# EAGLE design timelapse2routing (EAGLE 8.6.0)
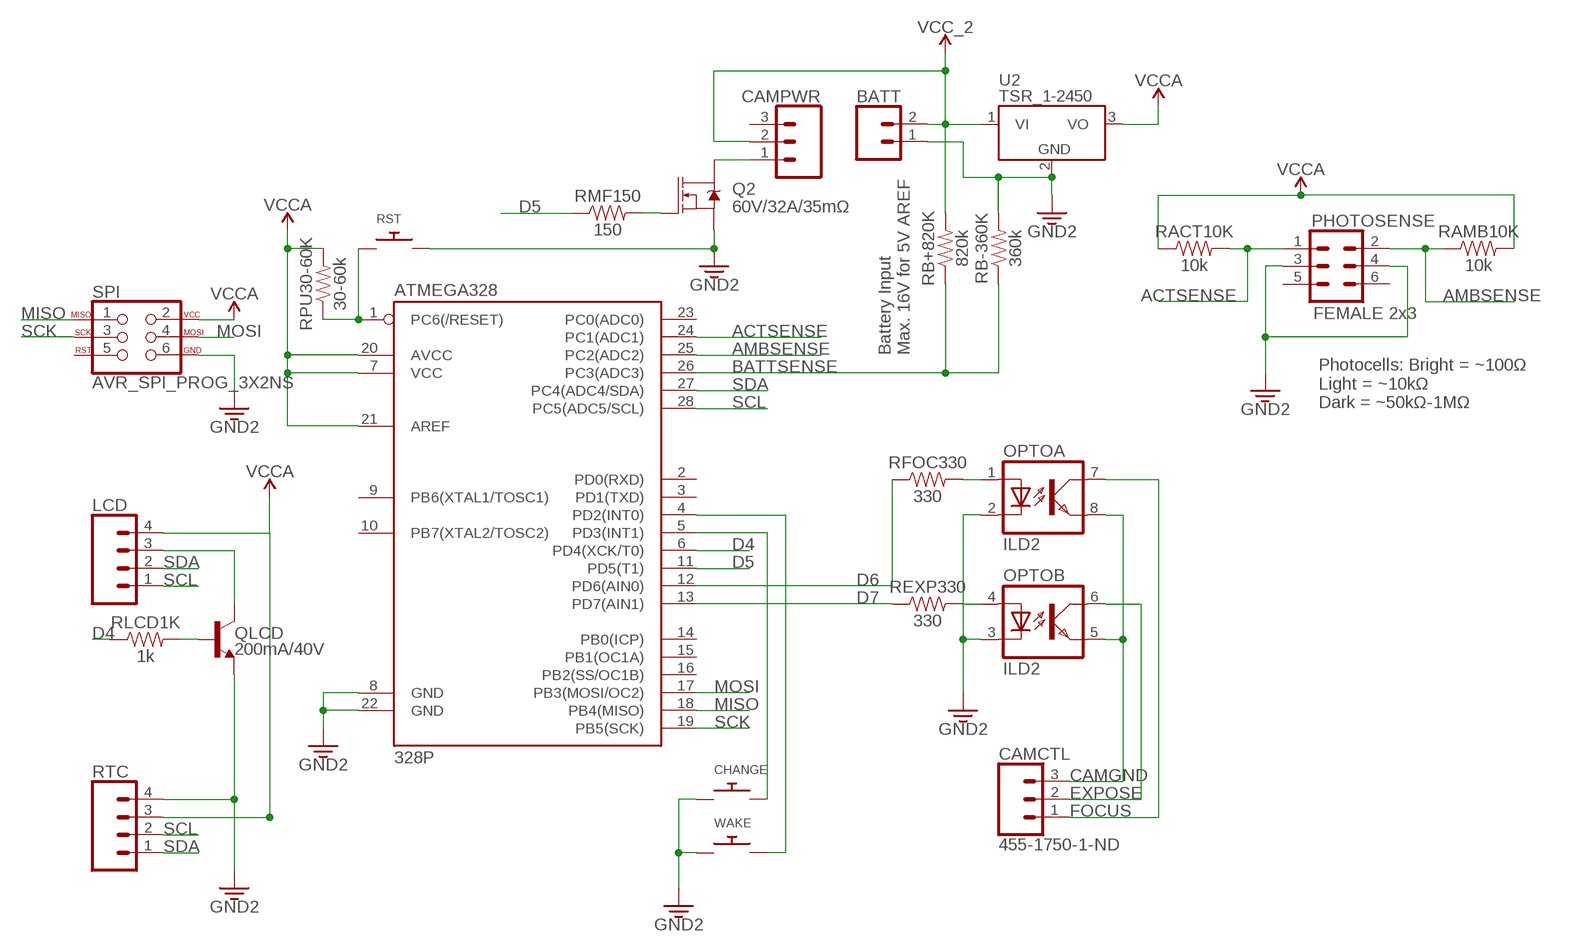
[diagram p0: schematic, sheet 1]

## Parts
ATMEGA328  328P  ATMEGA328P_PDIP  [DIP28]
BATT  CONN_02  [1X02]
CAMCTL  455-1750-1-ND  CONN_03  [1X03]
CAMPWR  CONN_03  [1X03]
CHANGE  SWITCH_PUSHBUTTONEVQ-PE  [TACT_PANA-EVQ]
LCD  CONN_04  [1X04]
OPTO  ILD2  [DIL08]
PHOTOSENSE  FEMALE 2x3  CONN_03X2FEMALE  [2X3]
Q2  60V/32A/35mΩ  MOSFET-NCH-FQP30N06L  [TO220V]
QLCD  200mA/40V  TRANS_NPN-2N3904  [TO-92]
RACT10K  10k  10KOHM-HORIZ-1/4W-1%  [AXIAL-0.3]
RAMB10K  10k  10KOHM-HORIZ-1/4W-1%  [AXIAL-0.3]
RB+820K  820k  10KOHM-HORIZ-1/4W-1%  [AXIAL-0.3]
RB-360K  360k  10KOHM-HORIZ-1/4W-1%  [AXIAL-0.3]
REXP330  330  330OHM-HORIZ-1/10W-5%  [AXIAL-0.3]
RFOC330  330  330OHM-HORIZ-1/10W-5%  [AXIAL-0.3]
RLCD1K  1k  330OHM-HORIZ-1/10W-5%  [AXIAL-0.3]
RMF150  150  330OHM-HORIZ-1/10W-5%  [AXIAL-0.3]
RPU30-60K  30-60k  330OHM-HORIZ-1/10W-5%  [AXIAL-0.3]
RST  SWITCH_PUSHBUTTONEVQ-PE  [TACT_PANA-EVQ]
RTC  CONN_04  [1X04]
SPI  AVR_SPI_PROG_3X2NS  [2X3-NS]
U2  TSR_1-2450  [TSR-1]
WAKE  SWITCH_PUSHBUTTONEVQ-PE  [TACT_PANA-EVQ]

## Nets
3.3V: ATMEGA328.8(GND) ATMEGA328.22(GND) ; supply symbol labelled GND2
ACTSENSE: ATMEGA328.24(PC1(ADC1)) PHOTOSENSE.1 RACT10K.P$2
AMBSENSE: ATMEGA328.25(PC2(ADC2)) PHOTOSENSE.2 RAMB10K.P$1
BATTSENSE: ATMEGA328.26(PC3(ADC3)) RB+820K.P$1 RB-360K.P$1
BATVCC [power]: BATT.2 CAMPWR.2 RB+820K.P$2 U2.1(VI) ; supply symbol labelled VCC_2
CAMGND: CAMCTL.3 OPTO.5(B:EMIT) OPTO.8(A:EMIT)
D4: ATMEGA328.6(PD4(XCK/T0)) RLCD1K.P$1
D5: ATMEGA328.11(PD5(T1)) RMF150.P$1
D6: ATMEGA328.12(PD6(AIN0)) RFOC330.P$1
D7: ATMEGA328.13(PD7(AIN1)) REXP330.P$1
EXPOSE: CAMCTL.2 OPTO.6(B:COL)
FOCUS: CAMCTL.1 OPTO.7(A:COL)
GND [power]: BATT.1 CHANGE.P$1 OPTO.2(A:C) OPTO.3(B:C) PHOTOSENSE.3 PHOTOSENSE.4 Q2.3(S) QLCD.1(E) RB-360K.P$2 RST.P$2 RTC.4 SPI.6 U2.2(GND) WAKE.P$1 ; supply symbol labelled GND2
MISO: ATMEGA328.18(PB4(MISO)) SPI.1
MOSI: ATMEGA328.17(PB3(MOSI/OC2)) SPI.4
N$1: OPTO.1(A:A) RFOC330.P$2
N$2: OPTO.4(B:A) REXP330.P$2
N$3: QLCD.2(B) RLCD1K.P$2
N$5 [power]: LCD.3 QLCD.3(C)
N$6: Q2.1(G) RMF150.P$2
N$7: ATMEGA328.5(PD3(INT1)) CHANGE.P$2
N$8: ATMEGA328.4(PD2(INT0)) WAKE.P$2
N$9 [power]: CAMPWR.1 Q2.2(D)
N$10: ATMEGA328.1(PC6(/RESET)) RPU30-60K.P$1 RST.P$1
SCK: ATMEGA328.19(PB5(SCK)) SPI.3
SCL: ATMEGA328.28(PC5(ADC5/SCL)) LCD.1 RTC.2
SDA: ATMEGA328.27(PC4(ADC4/SDA)) LCD.2 RTC.1
VCCA [power]: ATMEGA328.7(VCC) ATMEGA328.20(AVCC) ATMEGA328.21(AREF) LCD.4 RACT10K.P$1 RAMB10K.P$2 RPU30-60K.P$2 RTC.3 SPI.2 U2.3(VO)
Unconnected: ATMEGA328.2(PD0(RXD)) ATMEGA328.3(PD1(TXD)) ATMEGA328.9(PB6(XTAL1/TOSC1)) ATMEGA328.10(PB7(XTAL2/TOSC2)) ATMEGA328.14(PB0(ICP)) ATMEGA328.15(PB1(OC1A)) ATMEGA328.16(PB2(SS/OC1B)) ATMEGA328.23(PC0(ADC0)) CAMPWR.3 PHOTOSENSE.5 PHOTOSENSE.6 SPI.5

## Notes on the sheet
- Battery Input
  Max. 16V for 5V AREF
- Photocells: Bright = ~100Ω
  Light = ~10kΩ
  Dark = ~50kΩ-1MΩ

## Library data of the parts
ATMEGA328 = SparkFun-IC-Microcontroller:ATMEGA328P_PDIP: Atmel 328P Through hole ATMEGA328P uC used in the Arduino 32kb flash, 1k EEPROM, 2k SRAM Datasheet <http://www.sparkfun.com/datasheets/Components/SMD/ATMega328.pdf> SparkFun Products Storefront component: AVR 28 Pin 20MHz 32K 6A/D - ATMega328P <https://www.sparkfun.com/products/9061> (COM-09061) SparkFun Simon Says - Through-Hole Soldering Kit <https://www.sparkfun.com/products/10547> (KIT-10547) SparkFun Learn to Solder - Simon Says <https://www.sparkfun.com/products/13708> (KIT-13708) SparkFun BigTime Watch Kit <https://www.sparkfun.com/products/11734> (KIT-11734) SparkFun ClockIt <https://www.sparkfun.com/products/10930> (KIT-10930) SparkFun Serial Enabled LCD Kit <https://www.sparkfun.com/products/10097> (LCD-10097) SparkFun Simon Tilts - Through Hole Soldering Kit <https://www.sparkfun.com/products/12634> (KIT-12634) SparkFun Frequency Counter Kit <https://www.sparkfun.com/products/10140> (KIT-10140) FabFM Radio Kit <https://www.sparkfun.com/products/11043> (KIT-11043) SparkFun Binary Blaster Kit <https://www.sparkfun.com/products/12037> (KIT-12037) SparkFun Metro-Gnome <https://www.sparkfun.com/products/9236> (KIT-09236) ATmega328 with Arduino Optiboot (Uno) <https://www.sparkfun.com/products/10524> (DEV-10524); PROD_ID: IC-09136
BATT = SparkFun-Connectors:CONN_02: Multi connection point. Often used as Generic Header-pin footprint for 0.1 inch spaced/style header connections On any of the 0.1 inch spaced packages, you can populate with these: Break Away Headers - Straight <https://www.sparkfun.com/products/116> (PRT-00116) Break Away Male Headers - Right Angle <https://www.sparkfun.com/products/553> (PRT-00553) Female Headers <https://www.sparkfun.com/products/115> (PRT-00115) Break Away Headers - Machine Pin <https://www.sparkfun.com/products/117> (PRT-00117) Break Away Female Headers - Swiss Machine Pin <https://www.sparkfun.com/products/743> (PRT-00743) For SCREWTERMINALS and SPRING TERMINALS visit here: Screw Terimnals on SparkFun.com <https://www.sparkfun.com/search/results?term=Screw+Terminals> (5mm/3.5mm/2.54mm spacing) This device is also useful as a general connection point to wire up your design to another part of your project. Our various solder wires solder well into these plated through hole pads. Hook-Up Wire - Assortment (Stranded, 22 AWG) <https://www.sparkfun.com/products/11375> (PRT-11375) Hook-Up Wire - Assortment (Solid Core, 22 AWG) <https://www.sparkfun.com/products/11367> (PRT-11367) View the entire wire category on our website here <https://www.sparkfun.com/categories/141> Special notes: Molex polarized connector foot print use with: PRT-08233 with associated crimp pins and housings. 2.54_SCREWTERM for use with PRT-10571. 3.5mm Screw Terminal footprints for PRT-08084 5mm Screw Terminal footprints for use with PRT-08432
CAMCTL = SparkFun-Connectors:CONN_03: Multi connection point. Often used as Generic Header-pin footprint for 0.1 inch spaced/style header connections On any of the 0.1 inch spaced packages, you can populate with these: Break Away Headers - Straight <https://www.sparkfun.com/products/116> (PRT-00116) Break Away Male Headers - Right Angle <https://www.sparkfun.com/products/553> (PRT-00553) Female Headers <https://www.sparkfun.com/products/115> (PRT-00115) Break Away Headers - Machine Pin <https://www.sparkfun.com/products/117> (PRT-00117) Break Away Female Headers - Swiss Machine Pin <https://www.sparkfun.com/products/743> (PRT-00743) Stackable Header - 3 Pin (Female, 0.1") <https://www.sparkfun.com/products/13875> (PRT-13875) For SCREWTERMINALS and SPRING TERMINALS visit here: Screw Terimnals on SparkFun.com <https://www.sparkfun.com/search/results?term=Screw+Terminals> (5mm/3.5mm/2.54mm spacing) This device is also useful as a general connection point to wire up your design to another part of your project. Our various solder wires solder well into these plated through hole pads. Hook-Up Wire - Assortment (Stranded, 22 AWG) <https://www.sparkfun.com/products/11375> (PRT-11375) Hook-Up Wire - Assortment (Solid Core, 22 AWG) <https://www.sparkfun.com/products/11367> (PRT-11367) View the entire wire category on our website here <https://www.sparkfun.com/categories/141> Special notes: Molex polarized connector foot print use with SKU : PRT-08232 with associated crimp pins and housings.; PROD_ID: XXX-00000
CAMPWR = SparkFun-Connectors:CONN_03: Multi connection point. Often used as Generic Header-pin footprint for 0.1 inch spaced/style header connections On any of the 0.1 inch spaced packages, you can populate with these: Break Away Headers - Straight <https://www.sparkfun.com/products/116> (PRT-00116) Break Away Male Headers - Right Angle <https://www.sparkfun.com/products/553> (PRT-00553) Female Headers <https://www.sparkfun.com/products/115> (PRT-00115) Break Away Headers - Machine Pin <https://www.sparkfun.com/products/117> (PRT-00117) Break Away Female Headers - Swiss Machine Pin <https://www.sparkfun.com/products/743> (PRT-00743) Stackable Header - 3 Pin (Female, 0.1") <https://www.sparkfun.com/products/13875> (PRT-13875) For SCREWTERMINALS and SPRING TERMINALS visit here: Screw Terimnals on SparkFun.com <https://www.sparkfun.com/search/results?term=Screw+Terminals> (5mm/3.5mm/2.54mm spacing) This device is also useful as a general connection point to wire up your design to another part of your project. Our various solder wires solder well into these plated through hole pads. Hook-Up Wire - Assortment (Stranded, 22 AWG) <https://www.sparkfun.com/products/11375> (PRT-11375) Hook-Up Wire - Assortment (Solid Core, 22 AWG) <https://www.sparkfun.com/products/11367> (PRT-11367) View the entire wire category on our website here <https://www.sparkfun.com/categories/141> Special notes: Molex polarized connector foot print use with SKU : PRT-08232 with associated crimp pins and housings.; PROD_ID: XXX-00000; VALUE: 455-1750-1-ND
CHANGE RST WAKE = adafruit:SWITCH_PUSHBUTTON: Buttons SOFTTOUCHSMD_SJ - Soft touch temporary push button (Super Junk Akihabara) Compatible with SKPMANE010 [Mouser: 688-SKPMAN] C&K_KSS = Digikey: KSS221GLFS
LCD RTC = SparkFun-Connectors:CONN_04: Multi connection point. Often used as Generic Header-pin footprint for 0.1 inch spaced/style header connections On any of the 0.1 inch spaced packages, you can populate with these: Break Away Headers - Straight <https://www.sparkfun.com/products/116> (PRT-00116) Break Away Male Headers - Right Angle <https://www.sparkfun.com/products/553> (PRT-00553) Female Headers <https://www.sparkfun.com/products/115> (PRT-00115) Break Away Headers - Machine Pin <https://www.sparkfun.com/products/117> (PRT-00117) Break Away Female Headers - Swiss Machine Pin <https://www.sparkfun.com/products/743> (PRT-00743) For SCREWTERMINALS and SPRING TERMINALS visit here: Screw Terimnals on SparkFun.com <https://www.sparkfun.com/search/results?term=Screw+Terminals> (5mm/3.5mm/2.54mm spacing) This device is also useful as a general connection point to wire up your design to another part of your project. Our various solder wires solder well into these plated through hole pads. Hook-Up Wire - Assortment (Stranded, 22 AWG) <https://www.sparkfun.com/products/11375> (PRT-11375) Hook-Up Wire - Assortment (Solid Core, 22 AWG) <https://www.sparkfun.com/products/11367> (PRT-11367) View the entire wire category on our website here <https://www.sparkfun.com/categories/141> Special notes: Molex polarized connector foot print use with SKU : PRT-08231 with associated crimp pins and housings. 1MM SMD Version SKU: PRT-10208; PROD_ID: CONN-09696
OPTO = optocoupler-2:ILD2: SIEMENS OPTO COUPLER
PHOTOSENSE = SparkFun-Connectors:CONN_03X2: Multi connection point. Often used as Generic Header-pin footprint for 0.1 inch spaced/style header connections You can populate with any combo of single row headers, but if you'd like an exact match, check these: Header - 2x3 (Male, 0.1") <https://www.sparkfun.com/products/12807> (PRT-12807) Header - 2x3 (Female, 0.1") <https://www.sparkfun.com/products/13010> (PRT-13010) 2x3 Pin Shrouded Header <https://www.sparkfun.com/products/10877> (PRT-10877) On any of the 0.1 inch spaced packages, you can populate with these: Break Away Headers - Straight <https://www.sparkfun.com/products/116> (PRT-00116) Break Away Male Headers - Right Angle <https://www.sparkfun.com/products/553> (PRT-00553) Female Headers <https://www.sparkfun.com/products/115> (PRT-00115) Break Away Headers - Machine Pin <https://www.sparkfun.com/products/117> (PRT-00117) Break Away Female Headers - Swiss Machine Pin <https://www.sparkfun.com/products/743> (PRT-00743) Special note: the shrouded connector mates well with our 3x2 ribbon cables: Ribbon Crimp Connector - 6-pin (2x3, Female) <https://www.sparkfun.com/products/10651> (PRT-10651) Ribbon Cable - 6 wire (15ft) <https://www.sparkfun.com/products/10646> (PRT-10646); PROD_ID: CONN-11566
Q2 = SparkFun-DiscreteSemi:MOSFET-NCH: N-channel MOSFETs Voltage controlled devices that allow control of high current outputs. SparkFun Products: SparkFun OpenScale <https://www.sparkfun.com/products/13261> SparkFun Digital Sandbox <https://www.sparkfun.com/products/12651> SparkFun Monster Moto Shield <https://www.sparkfun.com/products/10182> SparkFun MOSFET Power Controller <https://www.sparkfun.com/products/11214>; PROD_ID: TRANS-10060
QLCD = SparkFun-DiscreteSemi:TRANS_NPN: NPN transistor Current controlled devices typically used to amplify current or used as a switch. BC547 - COM-08928 <http://www.sparkfun.com/products/8928> (TO-92 45V 100mA) (1.Collector 2.Base 3.Emitter) 2N3904 - COM-00521 <http://www.sparkfun.com/products/521> (TO-92 40V 200mA) (1.Emitter 2.Base 3.Collector) P2N2222A - COM-12852 <http://www.sparkfun.com/products/12852> (TO-92 40V 600mA) (1.Collector 2.Base 3.Emitter); PROD_ID: TRANS-08447
RACT10K RAMB10K = SparkFun-Resistors:10KOHM: 10kΩ resistor A resistor is a passive two-terminal electrical component that implements electrical resistance as a circuit element. Resistors act to reduce current flow, and, at the same time, act to lower voltage levels within circuits. - Wikipedia; PROD_ID: RES-12183
RB+820K RB-360K = SparkFun-Resistors:10KOHM: 10kΩ resistor A resistor is a passive two-terminal electrical component that implements electrical resistance as a circuit element. Resistors act to reduce current flow, and, at the same time, act to lower voltage levels within circuits. - Wikipedia; PROD_ID: RES-12183; VALUE: 10k
REXP330 RFOC330 = SparkFun-Resistors:330OHM: 330Ω resistor A resistor is a passive two-terminal electrical component that implements electrical resistance as a circuit element. Resistors act to reduce current flow, and, at the same time, act to lower voltage levels within circuits. - Wikipedia; PROD_ID: RES-8371
RLCD1K RMF150 RPU30-60K = SparkFun-Resistors:330OHM: 330Ω resistor A resistor is a passive two-terminal electrical component that implements electrical resistance as a circuit element. Resistors act to reduce current flow, and, at the same time, act to lower voltage levels within circuits. - Wikipedia; PROD_ID: RES-8371; VALUE: 330
SPI = SparkFun-Connectors:AVR_SPI_PROG_3X2: AVR ISP 6 Pin This is the reduced ISP connector for AVR programming. Common on Arduino. This footprint will take up less PCB space and can be used with a 10-pin to 6-pin adapter such as SKU: BOB-08508 **Special note about "TEST_POINT" package. The stop mask is on the top side, so if you want your programming test points to be on the bottom of your board, make sure to place this package on the bottom side of the board. This also ensure that the orientation to program from the bottom side will be correct. SparkFun Products: SparkFun ISP Pogo Adapter <https://www.sparkfun.com/products/11591> - NS Tiny AVR Programmer <https://www.sparkfun.com/products/11801> -PTH
U2 = _traco_tsr-1:TSR_1-*: TRACO TSR-1 Series Point-of-Load DC/DC-Converters Vi max. 36 V; Vo = (1.2 .. 15)V ±2%; Io = 0 .. 1 A SIP-Package (drop-in replacement for 78xx linear voltage regulators in TO220-package, vertically assembled) Source: www.tracopower.com Technologies: TSR 1- Vi (V) Vo (V) ±2% Io = 0 .. 1 A 24_ ( generic ) 2412 4.6 .. 36 1.2 2415 4.6 .. 36 1.5 2418 4.6 .. 36 1.8 2425 4.6 .. 36 2.5 2433 4.75.. 36 3.3 2450 6.5 .. 36 5.0 2465 9.0 .. 36 6.5 2490 12 .. 36 9.0 24120 15 .. 36 12 24150 18 .. 36 15 Author: Dipl.-Ing. FH Rainer Bayer HHN Hochschule Heilbronn, rainer.bayer@hs-heilbronn.de Ingenieurbüro ing-rb, mail@ing-rb.de

## Net classes
1 power: width 0.406 mm

## Board
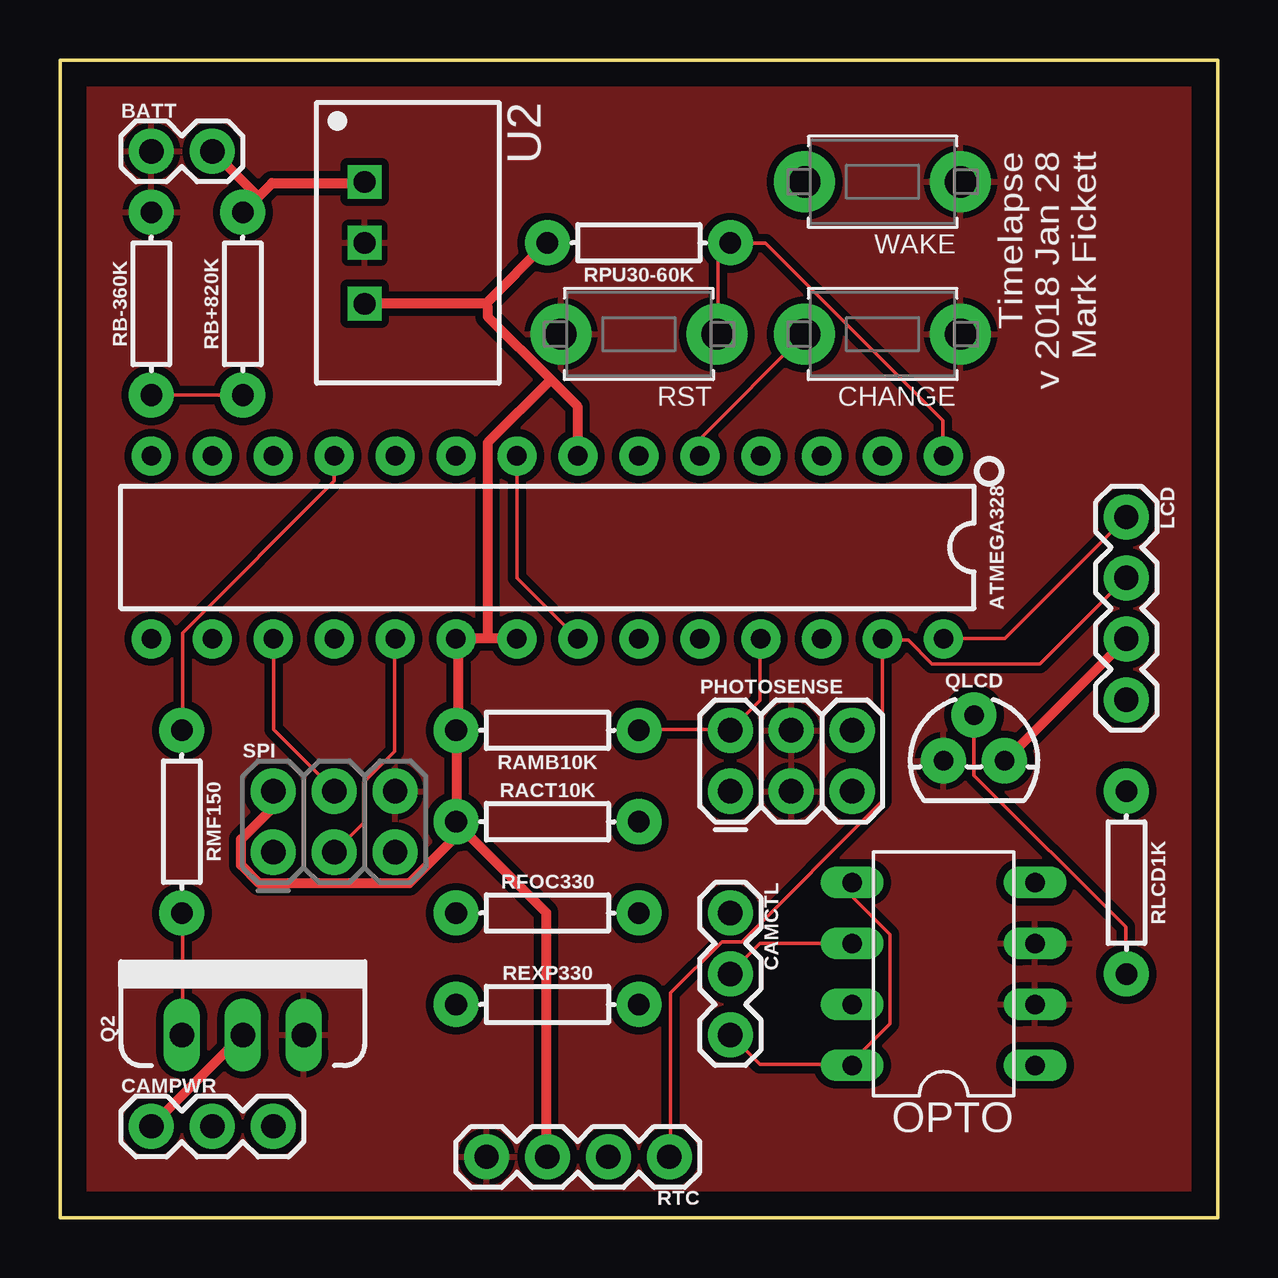
[diagram p1: board, top side]
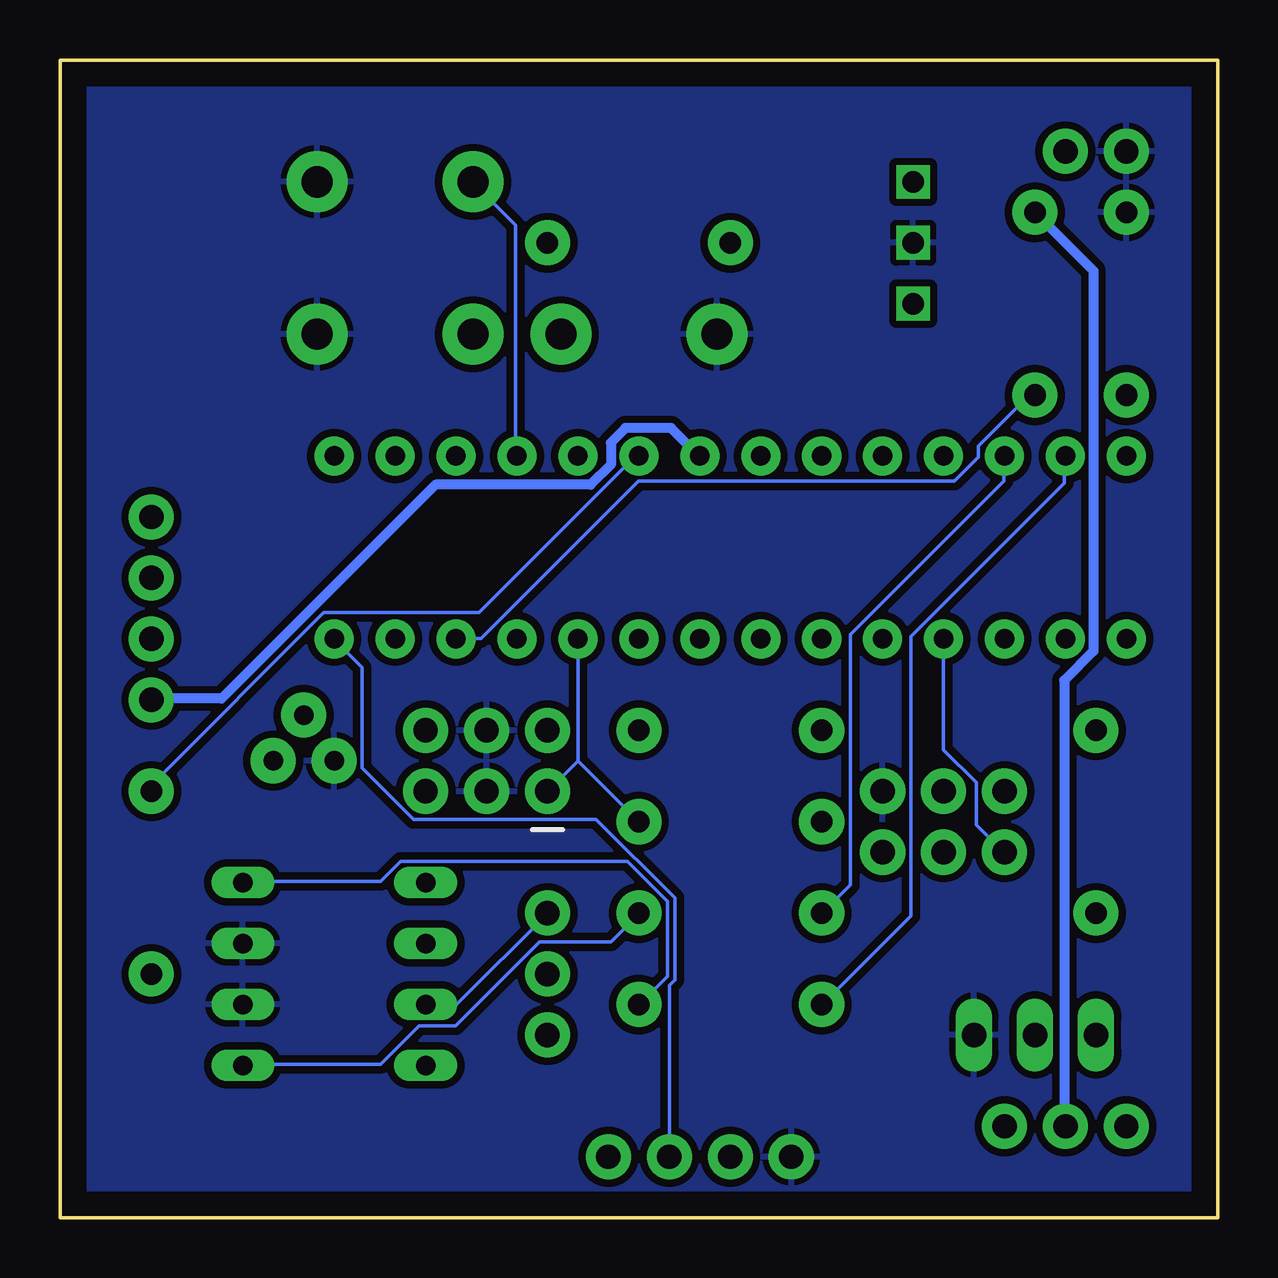
[diagram p2: board, bottom side, seen from below]

Size 48.26 x 48.26 mm. Coordinates in mm from the lower left corner, seen from the top.
Outline: 0,0 0,48.26 48.26,48.26 48.26,0 0,0
Copper layers (1*16): Top 0.035mm / dielectric 1.5mm / Bottom 0.035mm
Design rules "default": minimum track width 6mil, minimum drill 0.35mm, track to track 6mil, track to pad 6mil, pad to pad 6mil, via to via 6mil, smd to smd 6mil, copper to edge 40mil, drill to drill 6mil, minimum pad ring 10mil, minimum via ring 8mil, stop-mask expansion 4mil, vias tented up to drill 0mil, thermal gap 10mil

### Footprints (pad centres in the part's own frame; a part is rotated, then mirrored left to right if it is on the bottom)
DIP28 = drill 0.813 pad 1.626: 1 -16.51,-3.81; 2 -13.97,-3.81; 3 -11.43,-3.81; 4 -8.89,-3.81; 5 -6.35,-3.81; 6 -3.81,-3.81; 7 -1.27,-3.81; 8 1.27,-3.81; 9 3.81,-3.81; 10 6.35,-3.81; 11 8.89,-3.81; 12 11.43,-3.81; 13 13.97,-3.81; 14 16.51,-3.81; 15 16.51,3.81; 16 13.97,3.81; 17 11.43,3.81; 18 8.89,3.81; 19 6.35,3.81; 20 3.81,3.81; 21 1.27,3.81; 22 -1.27,3.81; 23 -3.81,3.81; 24 -6.35,3.81; 25 -8.89,3.81; 26 -11.43,3.81; 27 -13.97,3.81; 28 -16.51,3.81
1X02 = drill 1.016 pad 1.88: 1 0,0; 2 2.54,0
1X03 = drill 1.016 pad 1.88: 1 0,0; 2 2.54,0; 3 5.08,0
TACT_PANA-EVQ = drill 1.3 pad 2.54: P$1 -3.25,0; P$2 3.25,0
1X04 = drill 1.016 pad 1.88: 1 0,0; 2 2.54,0; 3 5.08,0; 4 7.62,0
DIL08 = drill 0.813 long: 1 -3.81,-3.81; 2 -1.27,-3.81; 3 1.27,-3.81; 4 3.81,-3.81; 5 3.81,3.81; 6 1.27,3.81; 7 -1.27,3.81; 8 -3.81,3.81
2X3 = drill 1.016 pad 1.88: 1 0,0; 2 0,2.54; 3 2.54,0; 4 2.54,2.54; 5 5.08,0; 6 5.08,2.54
TO220V = drill 1.016 long: 1 -2.54,0; 2 0,0; 3 2.54,0
TO-92 = drill 0.813 pad 1.88: 1 -1.27,0; 2 0,1.905; 3 1.27,0
AXIAL-0.3 = drill 0.9 pad 1.88: P$1 -3.81,0; P$2 3.81,0
2X3-NS = drill 1.016 pad 1.88: 1 -2.54,-1.27; 2 -2.54,1.27; 3 0,-1.27; 4 0,1.27; 5 2.54,-1.27; 6 2.54,1.27
TSR-1 = drill 0.9 square: 1 -2.54,0; 2 0,0; 3 2.54,0

### Placement (x,y rotation side)
ATMEGA328  20.32,27.94 180 top
BATT  3.81,44.45 0 top
CAMCTL  27.94,12.7 270 top
CAMPWR  3.81,3.81 0 top
CHANGE  34.29,36.83 180 top
LCD  44.45,29.21 270 top
OPTO  36.83,10.16 90 top
PHOTOSENSE  27.94,17.78 0 top
Q2  7.62,7.62 0 top
QLCD  38.1,19.05 0 top
RACT10K  20.32,16.51 0 top
RAMB10K  20.32,20.32 180 top
RB+820K  7.62,38.1 90 top
RB-360K  3.81,38.1 90 top
REXP330  20.32,8.89 0 top
RFOC330  20.32,12.7 0 top
RLCD1K  44.45,13.97 270 top
RMF150  5.08,16.51 270 top
RPU30-60K  24.13,40.64 180 top
RST  24.13,36.83 180 top
RTC  25.4,2.54 180 top
SPI  11.43,16.51 0 top
U2  12.7,40.64 270 top
WAKE  34.29,43.18 180 top

### Tracks (layer width: path | path; a pad name or v marks a point on that pad's centre or on a via)
3.3V
  Top 0.152: ATMEGA328.8 19.05,26.67 ATMEGA328.22
ACTSENSE
  Bottom 0.152: 26.67,19.05 ATMEGA328.24 | PHOTOSENSE.1 26.67,19.05 | 26.67,19.05 RACT10K.P$2
AMBSENSE
  Top 0.152: ATMEGA328.25 29.18,24.08 29.18,21.57 PHOTOSENSE.2 27.89,20.34 24.16,20.34 RAMB10K.P$1
BATTSENSE
  Top 0.152: RB+820K.P$1 RB-360K.P$1
  Bottom 0.152: RB+820K.P$1 7.85,34.29 9.98,32.16 9.98,31.7 10.97,30.71 24.16,30.71 30.71,24.16 31.7,24.16 ATMEGA328.26
BATVCC
  Top 0.406: U2.1 12.65,43.13 8.84,43.13 RB+820K.P$2 8.15,42.67 6.4,44.42 BATT.2
  Bottom 0.406: RB+820K.P$2 5.18,39.47 5.18,23.62 6.4,22.4 6.4,3.81 CAMPWR.2
CAMGND
  Top 0.152: CAMCTL.3 27.96,7.62 29.18,6.4 32.99,6.4 OPTO.8 32.99,6.48 34.59,8.08 34.59,11.81 33.07,13.34 33.07,13.95 OPTO.5
D4
  Bottom 0.152: ATMEGA328.6 24.16,31.7 24.31,31.7 30.79,25.22 37.26,25.22 44.42,18.06 44.42,17.83 RLCD1K.P$1
D5
  Top 0.152: ATMEGA328.11 11.43,30.71 5.11,24.38 5.11,20.34 RMF150.P$1
D6
  Bottom 0.152: ATMEGA328.12 8.91,31.7 8.91,30.71 15.32,24.31 15.32,13.87 16.46,12.72 RFOC330.P$1
D7
  Bottom 0.152: ATMEGA328.13 6.4,31.7 6.4,30.63 12.8,24.23 12.8,12.57 16.46,8.91 REXP330.P$1
EXPOSE
  Top 0.152: OPTO.6 29.18,11.43 27.96,10.21 CAMCTL.2
FOCUS
  Bottom 0.152: OPTO.7 32.99,8.91 31.7,8.91 27.96,12.65 CAMCTL.1
GND
  pour Top (isolate 0.305): 0,48.26 48.26,48.26 48.26,0 0,0
  pour Bottom (isolate 0.305): 0,0 0,48.26 48.26,48.26 48.26,0
MISO
  Bottom 0.152: ATMEGA328.18 11.43,19.51 10.06,18.14 10.06,16.38 8.91,15.24 SPI.1
MOSI
  Top 0.152: ATMEGA328.17 8.91,24.08 8.91,20.34 11.43,17.83 SPI.4
N$1
  Bottom 0.152: OPTO.1 40.62,6.4 34.9,6.4 33.3,8 31.77,8 28.27,11.51 25.3,11.51 24.16,12.65 RFOC330.P$2
N$2
  Bottom 0.152: OPTO.4 40.62,14.02 34.9,14.02 34.06,14.86 24.61,14.86 22.94,13.18 22.94,10.06 24.08,8.91 REXP330.P$2
N$3
  Top 0.152: QLCD.2 38.1,18.44 44.42,12.12 44.42,10.21 RLCD1K.P$2
N$5
  Top 0.406: QLCD.3 39.4,19.05 44.42,24.08 LCD.3
N$6
  Top 0.152: Q2.1 5.11,7.62 5.11,12.65 RMF150.P$2
N$7
  Top 0.152: ATMEGA328.5 26.67,32.46 31.01,36.8 CHANGE.P$2
N$8
  Bottom 0.152: ATMEGA328.4 29.26,31.77 29.26,41.38 31.01,43.13 WAKE.P$2
N$9
  Top 0.406: CAMPWR.1 Q2.2
N$10
  Top 0.152: ATMEGA328.1 36.8,31.77 36.8,33.22 29.41,40.62 27.96,40.62 RPU30-60K.P$1 27.89,40.62 27.43,40.16 27.43,36.88 RST.P$1
SCK
  Top 0.152: SPI.3 12.65,16.46 12.65,18.14 13.95,19.43 13.95,24.08 ATMEGA328.19
SCL
  Top 0.152: LCD.1 39.4,24.16 36.88,24.16 ATMEGA328.28
  Bottom 0.152: RTC.2 22.86,9.68 22.63,9.91 22.63,13.34 25.91,16.61 33.53,16.61 35.66,18.75 35.66,22.94 36.8,24.08 ATMEGA328.28
SDA
  Top 0.152: 34.29,24.08 35.36,24.08 36.35,23.09 40.84,23.09 44.42,26.67 LCD.2 | 34.29,24.08 34.29,17.37 28.42,11.51 27.58,11.51 25.45,9.37 25.45,2.59 RTC.1 | 34.29,24.08 ATMEGA328.27
VCCA
  Top 0.406: 17.83,24.16 19.05,24.16 ATMEGA328.21 | 17.83,24.16 16.54,24.16 ATMEGA328.20 16.61,24 16.61,20.5 RAMB10K.P$2 16.54,20.27 16.54,16.54 RACT10K.P$1 | RTC.3 20.27,2.59 20.27,12.72 16.61,16.38 RACT10K.P$1 | SPI.2 8.84,17.75 8.84,17.07 7.54,15.77 7.54,14.71 8.31,13.95 14.55,13.95 16.69,16.08 RACT10K.P$1 | 17.75,38.1 U2.3 | 17.75,38.1 20.27,40.62 RPU30-60K.P$2 | 20.46,34.94 17.83,37.57 17.83,37.95 17.75,38.1 | 20.46,34.94 21.57,33.83 21.57,31.77 ATMEGA328.7 | 17.83,24.16 17.83,32.31 20.46,34.94
  Bottom 0.406: LCD.4 44.42,21.64 41.53,21.64 32.61,30.56 26.14,30.56 25.3,31.39 25.3,32.31 24.69,32.92 22.78,32.92 21.64,31.77 ATMEGA328.7

### Text on the board
tNames: Timelapse / v 2018 Jan 28 / Mark Fickett